# EAGLE design LPC_2TE_new_mit_leds (EAGLE 5.01)
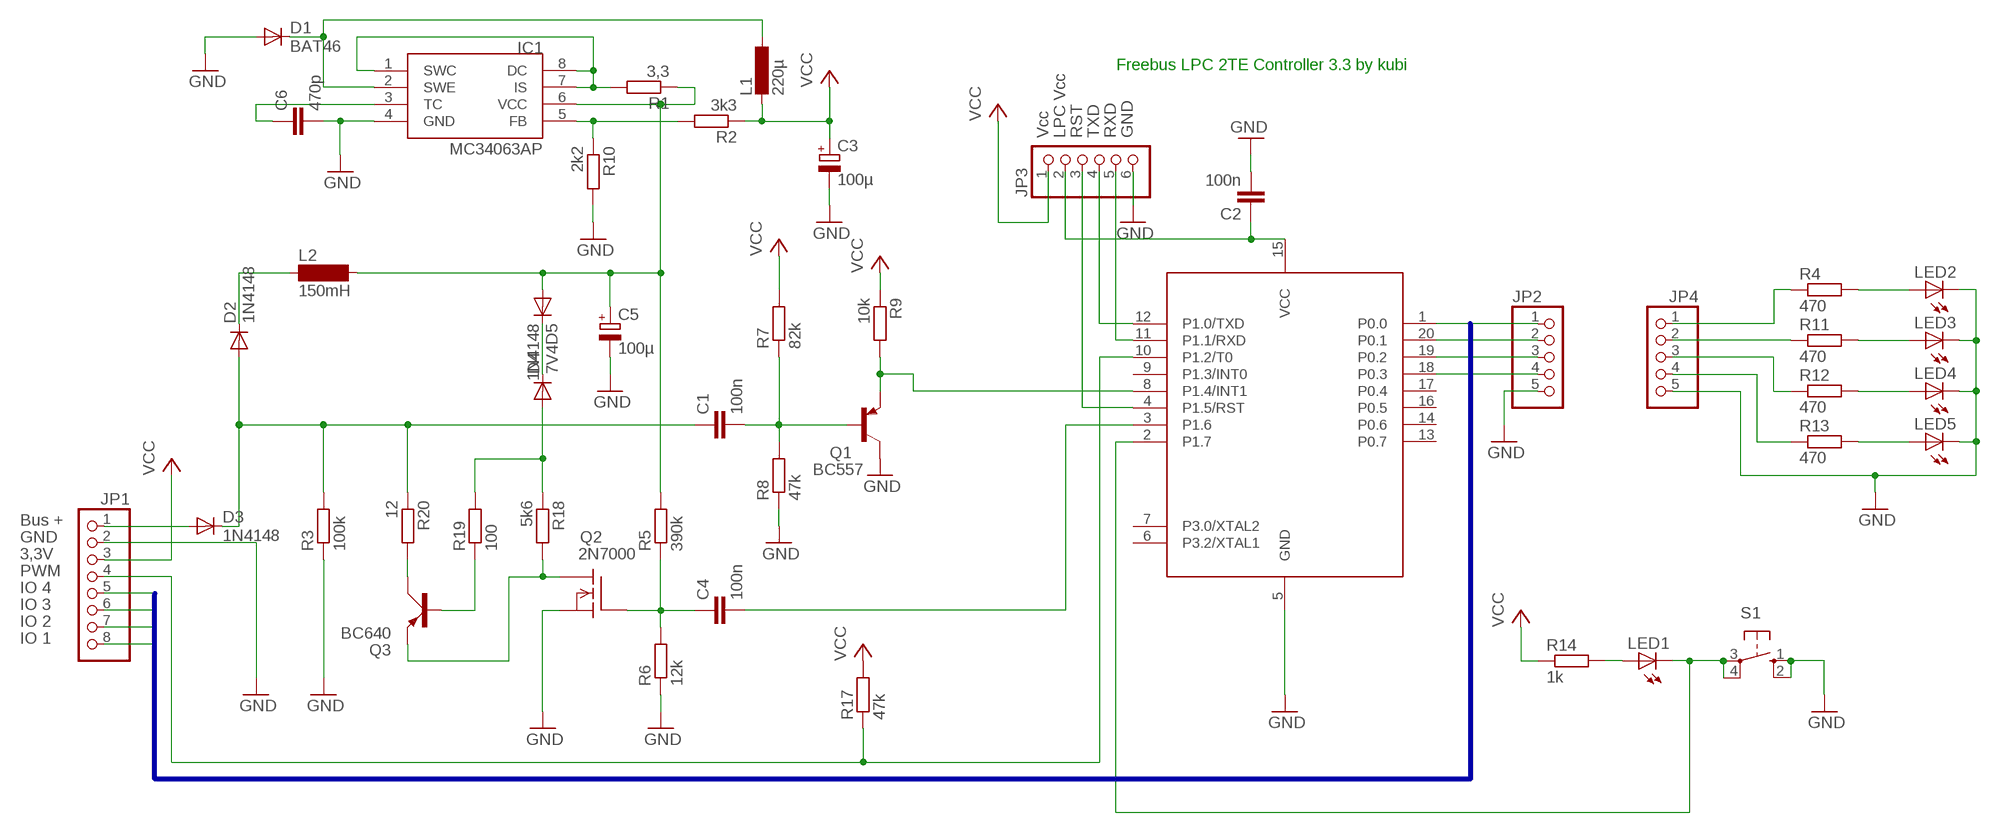
[diagram p0: schematic, sheet 1]

## Parts
C1  100n  C-EU050-024X044  [C050-024X044]
C2  100n  C-EUC1206  [C1206]
C3  100µ  CPOL-EUE3.5-8  [E3,5-8]
C4  100n  C-EU050-024X044  [C050-024X044]
C5  100µ  CPOL-EUE3.5-8  [E3,5-8]
C6  470p  C-EU025-024X044  [C025-024X044]
D1  BAT46  BAT81  [DO34-7]
D2  1N4148  [DO35-10]
D3  1N4148  DIODE-MINIMELF  [MINIMELF]
D4  7V4  DIODE-MINIMELF  [MINIMELF]
D5  1N4148  DIODE-MINIMELF  [MINIMELF]
IC1  MC34063AP  [DIL08]
JP1  PINHD-1X8  [1X08]
JP2  PINHD-1X5  [1X05]
JP3  PINHD-1X6  [1X06]
JP4  PINHD-1X5  [1X05]
L1  220µ  L-EU0207/2V  [0207/2V]
L2  150mH  SD12-1000  [SD12_1000]
LED1  LED3MM  [LED3MM]
LED2  LED3MM  [LED3MM]
LED3  LED3MM  [LED3MM]
LED4  LED3MM  [LED3MM]
LED5  LED3MM  [LED3MM]
Q1  BC557  [TO92]
Q2  2N7000  VN2222KM  [TO237]
Q3  BC640  [SOT54D]
R1  3,3  R-EU_M1206  [M1206]
R2  3k3  R-EU_0207/2V  [0207/2V]
R3  100k  R-EU_0207/2V  [0207/2V]
R4  470  R-EU_0204/7  [0204/7]
R5  390k  R-EU_M1206  [M1206]
R6  12k  R-EU_M1206  [M1206]
R7  82k  R-EU_0207/2V  [0207/2V]
R8  47k  R-EU_0207/2V  [0207/2V]
R9  10k  R-EU_M1206  [M1206]
R10  2k2  R-EU_0207/2V  [0207/2V]
R11  470  R-EU_0204/7  [0204/7]
R12  470  R-EU_0204/7  [0204/7]
R13  470  R-EU_0204/7  [0204/7]
R14  1k  R-EU_M1206  [M1206]
R17  47k  R-EU_0207/2V  [0207/2V]
R18  5k6  R-EU_0207/2V  [0207/2V]
R19  100  R-EU_M1206  [M1206]
R20  12  R-EU_M1206  [M1206]
S1  10-XX  [B3F-10XX]
U1  89LPC922  [TSSOP20]

## Nets
GND: C2.2 C3.- C5.- C6.2 D1.A IC1.4(GND) JP1.2 JP2.5 JP3.6 Q1.3(C) Q2.3(S) R3.1 R6.1 R8.1 R10.2 S1.1(S) S1.2(S1) U1.5(GND)
GND2: JP4.5 LED2.K(C) LED3.K(C) LED4.K(C) LED5.K(C) ; supply symbol labelled GND
N$1: Q1.1(E) R9.2 U1.8(P1.4/INT1)
N$2: C4.2 U1.3(P1.6)
N$3: JP1.4 R17.1 U1.10(P1.2/T0)
N$4: C1.1 D2.A D3.C R3.2 R20.1
N$6: Q2.1(D) Q3.E R18.2
N$7: LED1.K(C) S1.3(P) S1.4(P1) U1.2(P1.7)
N$8: IC1.1(SWC) IC1.7(IS) IC1.8(DC) R1.2
N$9: LED1.A R14.2
N$10: C5.+ D5.A IC1.6(VCC) L2.2 R1.1 R5.2
N$11: IC1.5(FB) R2.2 R10.1
N$12: D1.C IC1.2(SWE) L1.1
N$13: D4.C D5.C
N$14: C6.1 IC1.3(TC)
N$15: D3.A JP1.1
N$17: JP4.3 R12.1
N$18: JP4.2 R11.1
N$19: JP4.4 R13.1
N$20: JP4.1 R4.1
N$22: LED2.A R4.2
N$23: LED3.A R11.2
N$24: LED4.A R12.2
N$25: D4.A R18.1 R19.2
N$26: Q3.B R19.1
N$27: D2.C L2.1
N$28: Q3.C R20.2
N$29: JP3.4 U1.12(P1.0/TXD)
N$30: JP3.5 U1.11(P1.1/RXD)
N$31: JP3.3 U1.4(P1.5/RST)
N$32: C2.1 JP3.2 U1.15(VCC)
N$33: C4.1 Q2.2(G) R5.1 R6.2
N$34: C1.2 Q1.2(B) R7.1 R8.2
N$35: LED5.A R13.2
P0.0: JP1.8 JP2.1 U1.1(P0.0)
P0.1: JP1.7 JP2.2 U1.20(P0.1)
P0.2: JP1.6 JP2.3 U1.19(P0.2)
P0.3: JP1.5 JP2.4 U1.18(P0.3)
VCC: C3.+ JP1.3 JP3.1 L1.2 R2.1 R7.2 R9.1 R14.1 R17.2
Unconnected: U1.6(P3.2/XTAL1) U1.7(P3.0/XTAL2) U1.9(P1.3/INT0) U1.13(P0.7) U1.14(P0.6) U1.16(P0.5) U1.17(P0.4)

## Buses
P0.[0..3]

## Notes on the sheet
- Freebus LPC 2TE Controller 3.3 by kubi
- Vcc | LPC Vcc | RST | TXD | RXD | GND
- Bus +
- GND
- 3,3V
- PWM
- IO 4
- IO 3
- IO 2
- IO 1

## Library data of the parts
C1 C2 C4 C6 = rcl:C-EU: CAPACITOR, European symbol
C3 C5 = rcl:CPOL-EU: POLARIZED CAPACITOR, European symbol
D1 = diode:BAT81: DIODE barrier diode
D2 = diode:1N4148: DIODE high speed (Philips)
D3-D5 = diode:DIODE-: DIODE
IC1 = mc34063:MC34063
JP1 = pinhead:PINHD-1X8: PIN HEADER
JP2 JP4 = pinhead:PINHD-1X5: PIN HEADER
JP3 = pinhead:PINHD-1X6: PIN HEADER
L1 = rcl:L-EU: INDUCTOR, European symbol
L2 = inductor-neosid:SD12: INDUCTOR nominal inductance
LED1-LED5 = led:LED: LED OSRAM: - CHIPLED LG R971, LG N971, LY N971, LG Q971, LY Q971, LO R971, LY R971 LH N974, LH R974 LS Q976, LO Q976, LY Q976 LO Q996 - Hyper CHIPLED LW Q18S LB Q993, LB Q99A, LB R99A - SideLED LS A670, LO A670, LY A670, LG A670, LP A670 LB A673, LV A673, LT A673, LW A673 LH A674 LY A675 LS A676, LA A676, LO A676, LY A676, LW A676 LS A679, LY A679, LG A679 - Hyper Micro SIDELED® LS Y876, LA Y876, LO Y876, LY Y876 LT Y87S - SmartLED LW L88C, LW L88S LB L89C, LB L89S, LG L890 LS L89K, LO L89K, LY L89K LS L896, LA L896, LO L896, LY L896 - TOPLED LS T670, LO T670, LY T670, LG T670, LP T670 LSG T670, LSP T670, LSY T670, LOP T670, LYG T670 LG T671, LOG T671, LSG T671 LB T673, LV T673, LT T673, LW T673 LH T674 LS T676, LA T676, LO T676, LY T676, LB T676, LH T676, LSB T676, LW T676 LB T67C, LV T67C, LT T67C, LS T67K, LO T67K, LY T67K, LW E67C LS E67B, LA E67B, LO E67B, LY E67B, LB E67C, LV E67C, LT E67C LW T67C LS T679, LY T679, LG T679 LS T770, LO T770, LY T770, LG T770, LP T770 LB T773, LV T773, LT T773, LW T773 LH T774 LS E675, LA E675, LY E675, LS T675 LS T776, LA T776, LO T776, LY T776, LB T776 LHGB T686 LT T68C, LB T68C - Hyper Mini TOPLED® LB M676 - Mini TOPLED Santana® LG M470 LS M47K, LO M47K, LY M47K Source: http://www.osram.convergy.de - LUMILED® LXK2-PW12-R00, LXK2-PW12-S00, LXK2-PW14-U00, LXK2-PW14-V00 LXK2-PM12-R00, LXK2-PM12-S00, LXK2-PM14-U00 LXK2-PE12-Q00, LXK2-PE12-R00, LXK2-PE12-S00, LXK2-PE14-T00, LXK2-PE14-U00 LXK2-PB12-K00, LXK2-PB12-L00, LXK2-PB12-M00, LXK2-PB14-N00, LXK2-PB14-P00, LXK2-PB14-Q00 LXK2-PR12-L00, LXK2-PR12-M00, LXK2-PR14-Q00, LXK2-PR14-R00 LXK2-PD12-Q00, LXK2-PD12-R00, LXK2-PD12-S00 LXK2-PH12-R00, LXK2-PH12-S00 LXK2-PL12-P00, LXK2-PL12-Q00, LXK2-PL12-R00 Source: www.luxeon.com
Q1 = transistor-pnp:BC557: PNP Transistor
Q2 = transistor-fet:VN2222KM: N-Channel Enhancement MOSFET (VMOS); 60V; 0,5A; 7,5Ohm
Q3 = transistor-small-signal:BC640: PNP TRANSISTOR
R1-R14 R17-R20 = rcl:R-EU_: RESISTOR, European symbol
S1 = switch-omron:10-XX: OMRON SWITCH
U1 = lpc:89LPC922

## Board
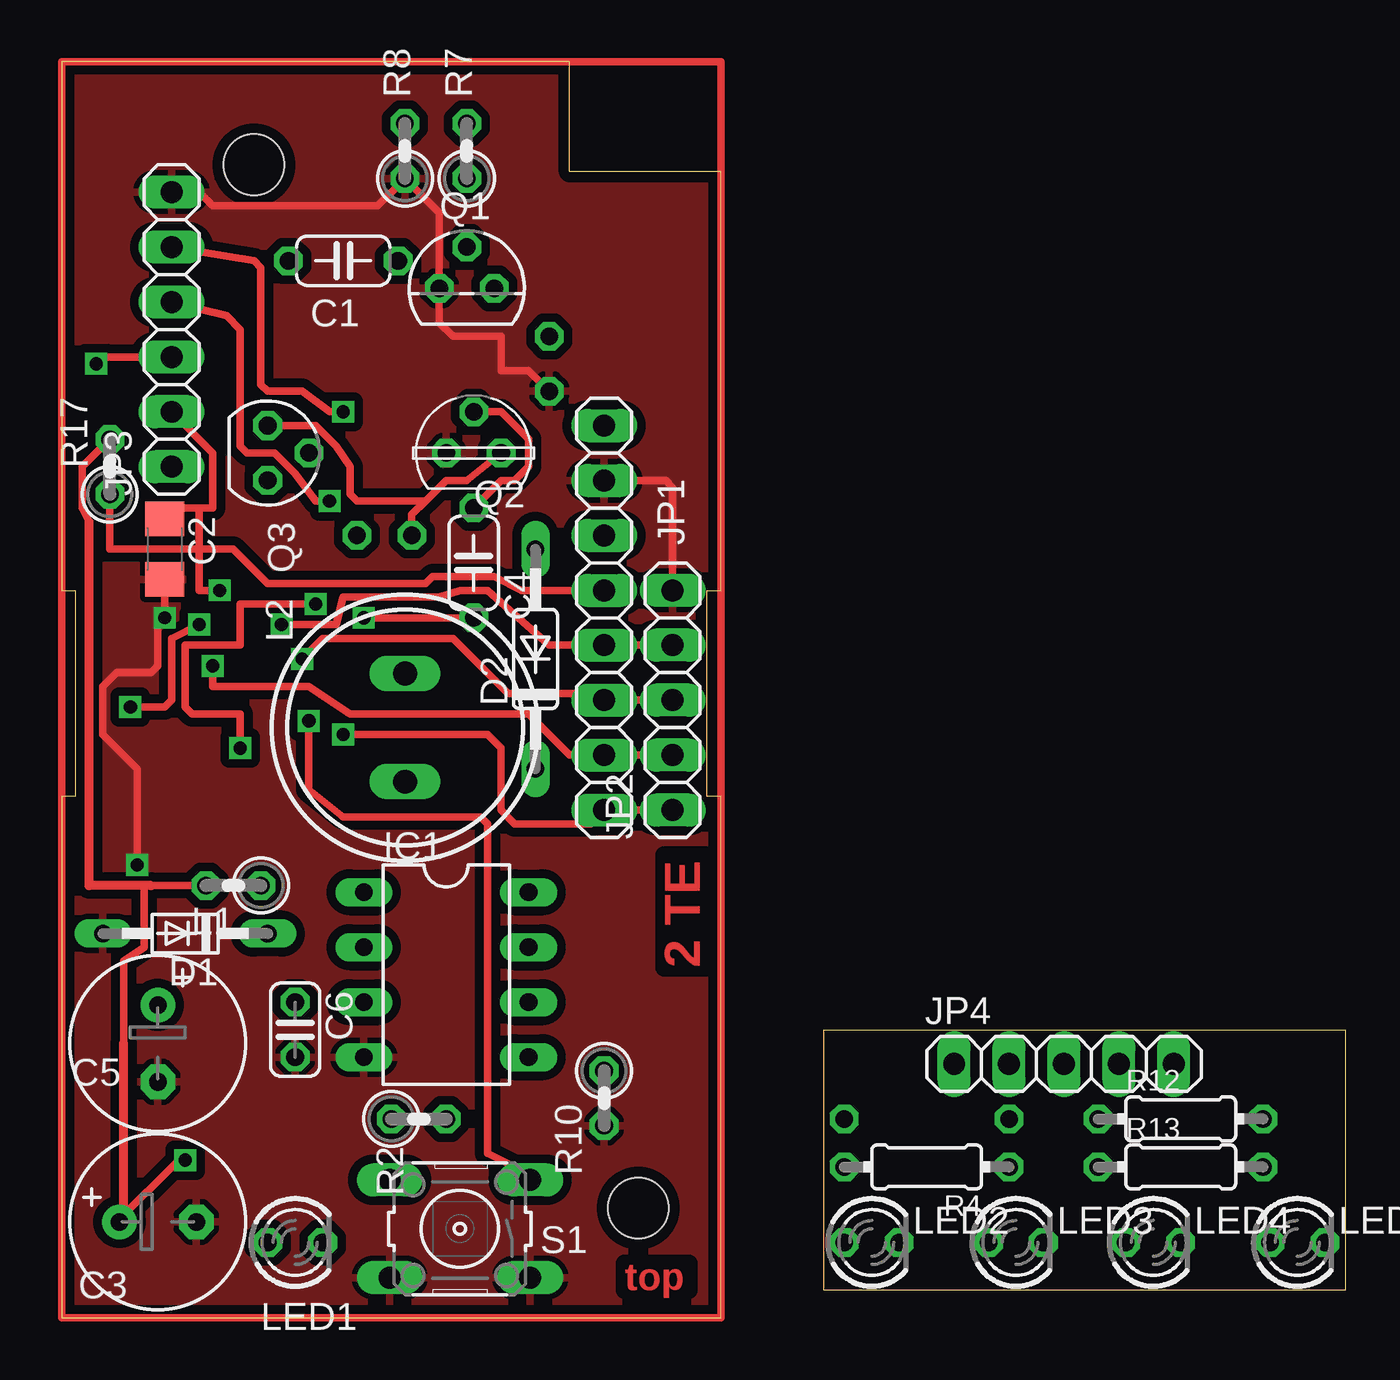
[diagram p1: board, top side]
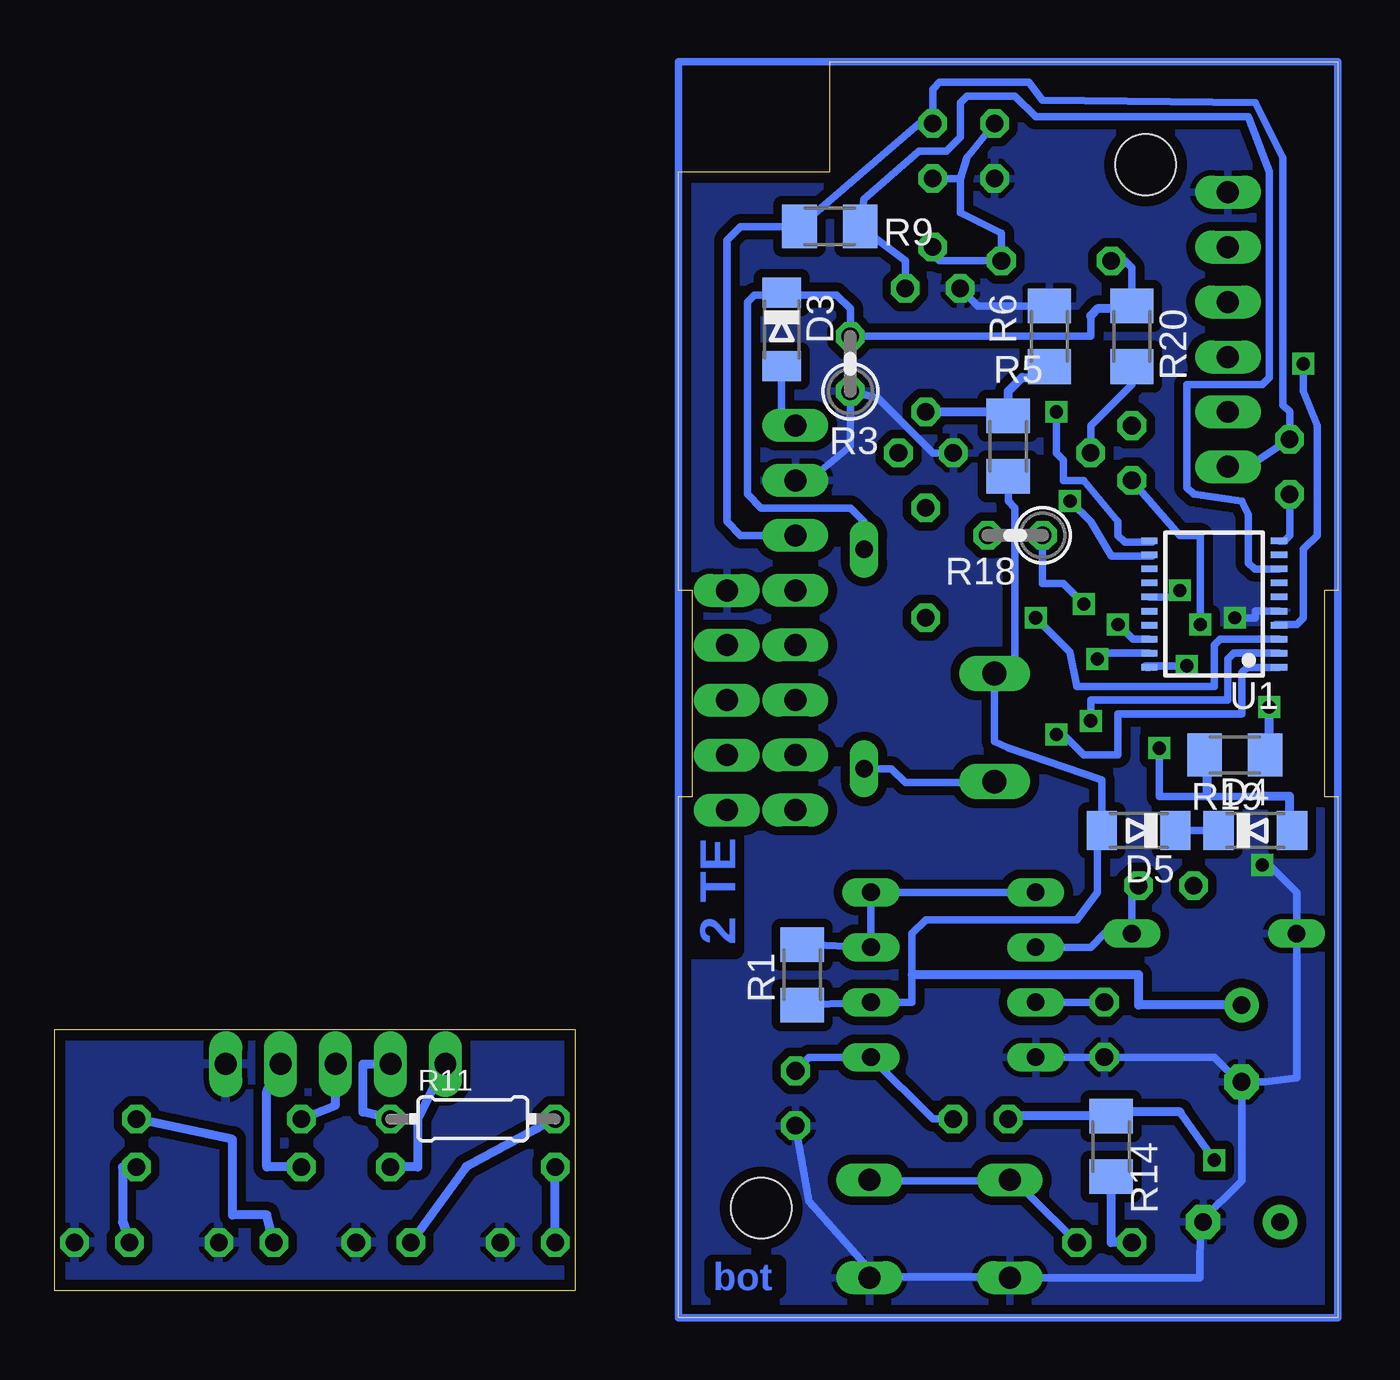
[diagram p2: board, bottom side, seen from below]

Size 59.37 x 58.1 mm. Coordinates in mm from the lower left corner, seen from the top.
Outline: 0,0 30.48,0 30.48,24.13 29.84,24.13 29.84,33.66 30.48,33.66 30.48,53.02 23.5,53.02 23.5,58.1 0,58.1 0,33.66 0.64,33.66 0.64,24.13 0,24.13 0,0
Outline: 35.24,13.34 59.37,13.34 59.37,1.27 35.24,1.27 35.24,13.34
Copper layers (1*16): Top 0.035mm / dielectric 1.5mm / Bottom 0.035mm
Design rules "default *": minimum track width 14mil, minimum drill 24mil, track to track 8mil, track to pad 8mil, pad to pad 10mil, via to via 10mil, smd to smd 8mil, copper to edge 20mil, drill to drill 8mil, minimum pad ring 10mil, minimum via ring 8mil, stop-mask expansion 4mil, vias tented up to drill 0mil, thermal gap 10mil
Holes 2.8 mm at 26.67,5.08 8.89,53.34

### Footprints (pad centres in the part's own frame; a part is rotated, then mirrored left to right if it is on the bottom)
C050-024X044 = drill 0.813 octagon: 1 -2.54,0; 2 2.54,0
C1206 = smd 1.6 x 1.8: 1 -1.4,0; 2 1.4,0
E3,5-8 = drill 0.813 pad 1.6 round: + -1.778,0 | drill 0.813 pad 1.6 octagon: - 1.778,0
C025-024X044 = drill 0.813 octagon: 1 -1.27,0; 2 1.27,0
DO34-7 = drill 0.813 long: A 3.81,0; C -3.81,0
DO35-10 = drill 0.813 long: A 5.08,0; C -5.08,0
MINIMELF = smd 1.4 x 1.8: A 1.7,0; C -1.7,0
DIL08 = drill 0.813 long: 1 -3.81,-3.81; 2 -1.27,-3.81; 3 1.27,-3.81; 4 3.81,-3.81; 5 3.81,3.81; 6 1.27,3.81; 7 -1.27,3.81; 8 -3.81,3.81
1X08 = drill 1.016 long: 1 -8.89,0; 2 -6.35,0; 3 -3.81,0; 4 -1.27,0; 5 1.27,0; 6 3.81,0; 7 6.35,0; 8 8.89,0
1X05 = drill 1.016 long: 1 -5.08,0; 2 -2.54,0; 3 0,0; 4 2.54,0; 5 5.08,0
1X06 = drill 1.016 long: 1 -6.35,0; 2 -3.81,0; 3 -1.27,0; 4 1.27,0; 5 3.81,0; 6 6.35,0
0207/2V = drill 0.813 octagon: 1 -1.27,0; 2 1.27,0
SD12_1000 = drill 1.1 long: 1 -2.5,0; 2 2.5,0
LED3MM = drill 0.813 octagon: A -1.27,0; K 1.27,0
TO92 = drill 0.813 octagon: 1 1.27,0; 2 0,1.905; 3 -1.27,0
TO237 = drill 0.813 octagon: 1 1.27,0; 2 0,1.905; 3 -1.27,0
SOT54D = drill 0.813 octagon: B 1.27,0; C 0,1.905; E -1.27,0
M1206 = smd 1.6 x 2: 1 -1.4,0; 2 1.4,0
0204/7 = drill 0.813 octagon: 1 -3.81,0; 2 3.81,0
B3F-10XX = drill 1.016 long: 1 -3.251,2.261; 2 3.251,2.261; 3 -3.251,-2.261; 4 3.251,-2.261
TSSOP20 = smd 0.3 x 0.75: 1 -2.925,-3; 2 -2.275,-3; 3 -1.625,-3; 4 -0.975,-3; 5 -0.325,-3; 6 0.325,-3; 7 0.975,-3; 8 1.625,-3; 9 2.275,-3; 10 2.925,-3; 11 2.925,3; 12 2.275,3; 13 1.625,3; 14 0.975,3; 15 0.325,3; 16 -0.325,3; 17 -0.975,3; 18 -1.625,3; 19 -2.275,3; 20 -2.925,3

### Placement (x,y rotation side)
C1  13.02,48.9 0 top
C2  4.76,35.56 270 top
C3  4.45,4.45 0 top
C4  19.05,34.92 270 top
C5  4.45,12.7 270 top
C6  10.79,13.34 270 top
D1  5.71,17.78 180 top
D2  21.91,30.48 90 top
D3  25.72,45.72 270 bottom
D4  3.81,22.54 0 bottom
D5  9.21,22.54 180 bottom
IC1  17.78,15.88 270 top
JP1  25.08,32.38 270 top
JP2  28.26,28.57 90 top
JP3  5.08,45.72 90 top
JP4  46.35,11.75 0 top
L1  7.94,20 180 top
L2  15.88,27.3 90 top
LED1  10.79,3.49 0 top
LED2  37.47,3.49 0 top
LED3  44.13,3.49 0 top
LED4  50.48,3.49 0 top
LED5  57.15,3.49 0 top
Q1  18.73,47.62 0 top
Q2  19.05,40.01 0 top
Q3  9.53,40.01 270 top
R1  24.77,15.88 90 bottom
R2  16.51,9.21 0 top
R3  22.54,44.13 90 bottom
R4  40.01,6.99 180 top
R5  15.24,40.32 270 bottom
R6  13.34,45.4 270 bottom
R7  18.73,53.98 90 top
R8  15.88,53.98 90 top
R9  23.5,50.48 0 bottom
R10  25.08,10.16 270 top
R11  40.01,9.21 0 bottom
R12  51.75,9.21 0 top
R13  51.75,6.99 0 top
R14  10.48,7.94 270 bottom
R17  2.22,39.37 90 top
R18  14.92,36.2 180 bottom
R19  4.76,26.04 180 bottom
R20  9.53,45.4 270 bottom
S1  18.41,4.13 180 top
U1  5.71,33.02 90 bottom

### Tracks (layer width: path | path; a pad name or v marks a point on that pad's centre or on a via)
GND  (via drill 0.6)
  Top 0.356: R3.1 21.59,43.81 20.32,43.81 20.32,45.4 18.1,45.4 17.46,46.04 Q1.3 17.46,51.12 R8.1 14.61,51.44 6.99,51.44 6.35,52.07 JP3.6 | 4.76,34.29 C2.2 v4.76,32.38 4.45,32.07 4.45,30.16 4.13,29.84 2.54,29.84 1.91,29.21 1.91,26.99 3.49,25.4 v3.49,20.95 | JP2.5 28.26,38.42 27.94,38.73 JP1.2
  Bottom 0.356: 6.35,4.45 6.39,1.87 S1.2 15.2,1.87 15.24,1.91 21.59,1.91 | IC1.4 C6.2 5.71,12.06 4.45,10.79 C5.- | C5.- 3.37,10.92 1.91,11.11 D1.A 1.91,19.68 3.17,20.95 v3.49,20.95 | 6.35,4.45 C3.- | C5.- 4.45,6.35 6.35,4.45 | Q2.3 18.73,40.01 21.27,42.55 R3.1 22.54,40.32 24.45,38.73 JP1.2 | R10.2 24.45,5.4 21.91,2.54 21.59,2.22 21.59,1.91 | S1.1 21.63,1.87 21.59,1.91 | U1.5 3.81,32.7 3.81,32.38 v4.76,32.38 | R6.1 16.64,46.8 Q1.3
  pour Top (isolate 0.406): 0,58.1 30.48,58.1 30.48,52.7 30.48,42.55 30.48,31.75 30.48,19.05 30.48,6.67 30.48,0 0,0 0,0.64 0,7.3 0,21.27 0,34.92 0,48.26
  pour Bottom (isolate 0.406): 0,58.1 30.48,58.1 30.48,52.39 30.48,6.35 30.48,0 0,0
GND2
  pour Bottom (isolate 0.406): 35.24,13.34 59.37,13.34 59.37,1.27 35.24,1.27
N$1
  Bottom 0.356: Q1.1 20,48.9 R9.2 21.91,51.75 19.37,53.98 18.1,53.98 17.46,54.61 17.46,56.2 17.14,56.52 14.92,56.52 13.97,55.56 4.13,55.56 3.17,53.02 3.17,43.5 3.49,43.18 6.99,43.18 6.99,38.42 6.67,38.1 4.45,37.78 4.13,37.15 4.13,34.92 3.85,34.65 U1.8
N$2  (via drill 0.61)
  Top 0.356: v13.97,32.38 C4.2
  Bottom 0.356: U1.3 5.43,31.39 5.71,31.11 5.71,29.21 12.06,29.21 12.38,30.8 v13.97,32.38
N$3
  Top 0.356: JP1.4 21.27,33.66 20,34.29 17.14,34.29 16.83,33.97 9.53,33.97 7.94,35.56 2.22,35.56 R17.1
  Bottom 0.356: U1.10 2.47,35.95 2.22,36.2 R17.1
N$4
  Bottom 0.356: D2.A 21.91,36.83 22.54,37.47 26.67,37.47 27.3,38.1 27.3,46.99 26.99,47.31 25.72,47.31 | 25.72,47.31 23.18,47.31 22.54,46.67 R3.2 11.43,45.4 11.43,46.35 | 25.72,47.31 D3.C | R20.1 9.53,48.58 9.84,48.9 C1.1
  Bottom 0.406: R20.1 9.53,46.67 11.11,46.67 11.43,46.35
N$5
  Bottom 0.356: 0,58.1 30.48,58.1 30.48,0 0,0 0,58.1
N$6
  Top 0.356: Q2.1 18.73,38.73 17.78,38.73 16.83,37.78 | 16.83,37.78 13.65,37.78 13.34,38.1 13.34,39.37 12.7,40.32 11.75,41.27 Q3.E | R18.2 16.19,37.15 16.83,37.78
N$7  (via drill 0.61)
  Top 0.356: v11.43,27.62 11.43,24.45 13.02,23.18 19.37,23.18 19.68,22.86 19.68,7.62 20.95,6.99 21.63,6.39 S1.3
  Bottom 0.356: LED1.K 14.33,5.75 S1.4 15.2,6.39 15.24,6.35 21.59,6.35 21.63,6.39 S1.3 | U1.2 4.82,30.75 5.08,30.48 5.08,28.57 11.43,28.57 v11.43,27.62
N$8
  Bottom 0.356: R1.2 IC1.7 IC1.8 IC1.1
N$9
  Bottom 0.406: 10.48,6.67 R14.2 10.48,3.49 LED1.A
N$10
  Bottom 0.356: R1.1 IC1.6 19.68,14.61 19.68,15.88 19.68,17.78 19.05,18.41 12.06,18.41 11.11,19.68 11.11,22.54 | R5.2 15.24,37.78 14.92,37.47 14.92,29.84 15.88,29.84 | D5.A 10.91,24.88 14.29,26.04 15.24,26.35 15.88,26.67 15.88,29.84 | 15.88,29.84 L2.2
  Bottom 0.406: C5.+ 9.21,14.48 9.21,15.88 19.68,15.88 | 11.11,22.54 D5.A
N$11
  Bottom 0.356: R2.2 18.73,9.21 IC1.5 24.45,12.06 R10.1
N$12
  Bottom 0.356: IC1.2 11.43,17.14 10.79,17.78 D1.C 9.53,19.68 L1.1
N$13
  Bottom 0.356: D5.C D4.C
N$14
  Bottom 0.356: C6.1 IC1.3
N$15
  Bottom 0.356: D3.A 25.72,41.91 JP1.1
N$16
  Top 0.356: 0,58.1 30.48,58.1 30.48,0 0,0 0,58.1
N$17
  Bottom 0.406: R12.1 46.35,9.84 JP4.3
N$18
  Bottom 0.406: R11.1 45.09,9.53 45.09,11.75 JP4.2
N$19
  Bottom 0.406: R13.1 49.53,6.99 49.53,10.48 JP4.4
N$20
  Bottom 0.406: JP4.1 42.55,9.21 42.55,6.99 R4.1
N$22
  Bottom 0.406: LED2.A R4.2
N$23
  Bottom 0.406: R11.2 40.32,6.99 LED3.A
N$24
  Bottom 0.406: R12.2 51.12,8.26 51.12,4.76 49.53,4.76 LED4.A
N$25  (via drill 0.61)
  Top 0.356: v11.75,33.02 8.26,33.02 8.26,31.11 5.71,31.11 5.71,28.26 6.03,27.94 8.26,27.94 v8.26,26.35
  Bottom 0.356: R18.1 13.65,33.97 12.7,33.97 v11.75,33.02 | v8.26,26.35 8.26,24.13 6.03,24.13 3.49,24.13 3.36,24.13
  Bottom 0.406: D4.A 2.22,22.54 2.22,24.13 3.49,24.13 | R19.2 6.03,26.04 6.03,24.13
N$26  (via drill 0.61)
  Top 0.356: v6.35,32.07 5.08,31.43 5.08,28.57 4.76,28.26 v3.17,28.26
  Bottom 0.356: v6.35,32.07 6.35,36.2 7.3,36.2 Q3.B
  Bottom 0.406: R19.1 3.17,26.04 v3.17,28.26
N$27
  Bottom 0.356: L2.1 15.88,24.77 20,24.77 20.64,25.4 D2.C
N$28
  Bottom 0.356: R20.2 9.53,43.18 11.43,41.27 Q3.C
N$29  (via drill 0.61)
  Top 0.356: JP3.4 7.62,46.35 8.26,45.72 8.26,40.32 8.57,40.01 9.84,40.01 10.79,39.05 11.75,37.78 v12.38,37.78
  Bottom 0.356: v12.38,37.78 11.43,36.83 10.48,35.24 8.57,35.24 8.62,35.3 U1.12
N$30  (via drill 0.61)
  Top 0.356: JP3.5 8.89,48.9 9.21,48.58 9.21,43.18 9.53,42.86 11.11,42.86 12.38,41.91 v13.02,41.91
  Bottom 0.356: v13.02,41.91 13.02,40.01 12.7,39.69 12.7,38.73 11.75,38.73 10.16,36.83 10.16,36.2 9.84,35.88 8.57,35.88 8.64,35.95 U1.11
N$31  (via drill 0.61)
  Top 0.356: JP3.3 1.91,44.45 v1.59,44.13
  Bottom 0.356: v1.59,44.13 1.59,42.86 0.95,41.27 0.95,36.2 1.59,35.56 1.59,32.38 1.91,32.07 2.86,32.07 2.83,32.05 U1.4
N$32  (via drill 0.6)
  Top 0.356: JP3.2 6.99,40.01 6.99,37.47 6.35,37.47 | 4.76,36.51 C2.1 4.76,37.47 6.35,37.47 | v7.3,33.66 6.35,33.66 6.35,37.47
  Bottom 0.356: v7.3,33.66 7.3,33.34 U1.15
N$33
  Top 0.356: Q2.2 20.32,41.91 21.59,40.64 21.59,39.37 20.95,38.73 20.32,38.73 C4.1
  Bottom 0.406: Q2.2 15.24,41.91 R5.1 | R5.1 15.24,41.59 | R5.1 15.24,42.86 14.61,43.5 13.65,43.5 13.34,43.81 | 13.34,43.81 13.34,43.5 | 13.34,43.81 R6.2
N$34
  Bottom 0.356: Q1.2 18.73,49.21 18.41,48.9 C1.2 15.56,50.16 17.46,51.12 17.46,52.7 | R8.2 17.14,53.66 17.46,52.7 | 17.46,52.7 R7.1
N$35
  Bottom 0.406: R13.2 56.2,6.99 56.2,4.45 LED5.A
P0.0  (via drill 0.61)
  Top 0.356: v13.02,26.99 19.68,26.99 20.32,26.35 20.32,23.5 20.95,22.86 24.45,22.86 JP1.8 JP2.1
  Bottom 0.356: U1.1 4.2,30.09 4.45,29.84 4.45,27.94 10.16,27.94 10.16,26.04 11.75,26.04 12.7,26.99 v13.02,26.99
P0.1  (via drill 0.61)
  Top 0.356: v6.99,30.16 6.99,29.21 11.43,29.21 13.34,27.94 21.59,27.94 23.5,26.04 JP1.7 JP2.2
  Bottom 0.356: U1.20 8.82,30.09 8.89,30.16 v6.99,30.16
P0.2  (via drill 0.61)
  Top 0.356: v11.11,30.48 12.06,31.43 18.1,31.43 20.64,28.89 24.77,28.89 JP1.6 JP2.3
  Bottom 0.356: U1.19 10.74,30.75 v11.11,30.48
P0.3  (via drill 0.61)
  Top 0.356: v10.16,32.07 12.7,32.07 13.02,33.34 17.46,33.34 18.41,33.66 19.68,33.66 22.54,31.11 JP1.5 JP2.4
  Bottom 0.356: U1.18 9.49,31.39 v10.16,32.07
VCC  (via drill 0.61)
  Top 0.356: C3.+ 2.54,4.45 5.4,7.3 v5.71,7.3 | L1.2 4.13,20 3.81,20 3.81,17.14 2.86,16.51 2.86,12.7 | 1.27,36.83 0.95,37.47 0.95,39.37 R17.2
  Top 0.406: 4.13,20 1.27,20 1.27,36.83 | C3.+ 2.86,4.45 2.86,12.7
  Bottom 0.356: JP3.1 4.13,39.37 R17.2 2.22,41.91 2.54,42.23 2.54,53.66 3.81,56.2 13.65,56.33 14.29,57.15 18.41,57.15 18.73,56.83 R7.2 19.37,55.24 R9.1 27.62,50.48 28.26,49.85 28.26,36.83 27.62,36.2 JP1.3 | v5.71,7.3 7.3,9.53
  Bottom 0.406: 7.3,9.53 10.48,9.53 R14.1 15.24,9.34 R2.1

### Text on the board
Top: 2 TE | top
Bottom: 2 TE | bot